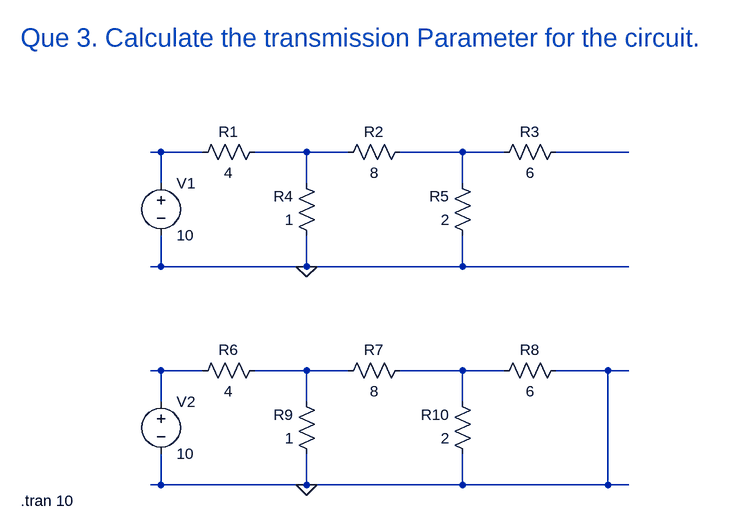
[diagram p0: schematic 3_Dheerendra_23EE019_Two_Port_T_Para.asc]
3_Dheerendra_23EE019_Two_Port_T_Para.asc, the LTspice schematic file:
Version 4
SHEET 1 1136 680
WIRE -16 96 -32 96
WIRE 48 96 -16 96
WIRE 208 96 128 96
WIRE 272 96 208 96
WIRE 448 96 352 96
WIRE 512 96 448 96
WIRE 704 96 592 96
WIRE -16 144 -16 96
WIRE 208 144 208 96
WIRE 448 144 448 96
WIRE -16 272 -16 224
WIRE -16 272 -32 272
WIRE 208 272 208 224
WIRE 208 272 -16 272
WIRE 448 272 448 224
WIRE 448 272 208 272
WIRE 704 272 448 272
WIRE -16 432 -32 432
WIRE 48 432 -16 432
WIRE 208 432 128 432
WIRE 272 432 208 432
WIRE 448 432 352 432
WIRE 512 432 448 432
WIRE 672 432 592 432
WIRE 704 432 672 432
WIRE -16 480 -16 432
WIRE 208 480 208 432
WIRE 448 480 448 432
WIRE -16 608 -16 560
WIRE -16 608 -32 608
WIRE 208 608 208 560
WIRE 208 608 -16 608
WIRE 448 608 448 560
WIRE 448 608 208 608
WIRE 672 608 672 432
WIRE 672 608 448 608
WIRE 704 608 672 608
FLAG 208 272 0
FLAG 208 608 0
SYMBOL res 144 80 R90
WINDOW 0 0 56 VBottom 2
WINDOW 3 32 56 VTop 2
SYMATTR InstName R1
SYMATTR Value 4
SYMBOL res 368 80 R90
WINDOW 0 0 56 VBottom 2
WINDOW 3 32 56 VTop 2
SYMATTR InstName R2
SYMATTR Value 8
SYMBOL res 608 80 R90
WINDOW 0 0 56 VBottom 2
WINDOW 3 32 56 VTop 2
SYMATTR InstName R3
SYMATTR Value 6
SYMBOL res 224 240 R180
WINDOW 0 36 76 Left 2
WINDOW 3 36 40 Left 2
SYMATTR InstName R4
SYMATTR Value 1
SYMBOL res 464 240 R180
WINDOW 0 36 76 Left 2
WINDOW 3 36 40 Left 2
SYMATTR InstName R5
SYMATTR Value 2
SYMBOL res 144 416 R90
WINDOW 0 0 56 VBottom 2
WINDOW 3 32 56 VTop 2
SYMATTR InstName R6
SYMATTR Value 4
SYMBOL res 368 416 R90
WINDOW 0 0 56 VBottom 2
WINDOW 3 32 56 VTop 2
SYMATTR InstName R7
SYMATTR Value 8
SYMBOL res 608 416 R90
WINDOW 0 0 56 VBottom 2
WINDOW 3 32 56 VTop 2
SYMATTR InstName R8
SYMATTR Value 6
SYMBOL res 224 576 R180
WINDOW 0 36 76 Left 2
WINDOW 3 36 40 Left 2
SYMATTR InstName R9
SYMATTR Value 1
SYMBOL res 464 576 R180
WINDOW 0 36 76 Left 2
WINDOW 3 36 40 Left 2
SYMATTR InstName R10
SYMATTR Value 2
SYMBOL voltage -16 128 R0
WINDOW 123 0 0 Left 0
WINDOW 39 0 0 Left 0
SYMATTR InstName V1
SYMATTR Value 10
SYMBOL voltage -16 464 R0
WINDOW 123 0 0 Left 0
WINDOW 39 0 0 Left 0
SYMATTR InstName V2
SYMATTR Value 10
TEXT -232 -80 Left 4 ;Que 3. Calculate the transmission Parameter for the circuit.
TEXT -232 632 Left 2 !.tran 10

The netlist it stands for:
* 3_Dheerendra_23EE019_Two_Port_T_Para.asc
R1 N002 N001 4
R2 N003 N002 8
R3 N004 N003 6
R4 0 N002 1
R5 0 N003 2
R6 N006 N005 4
R7 N007 N006 8
R8 0 N007 6
R9 0 N006 1
R10 0 N007 2
V1 N001 0 10
V2 N005 0 10
* Que 3. Calculate the transmission Parameter for the circuit.
.tran 10
.backanno
.end